# EAGLE board Proiect_TSC_Ilinca-Roxana_Tololoi (EAGLE 9.7.0), part 1 of 2
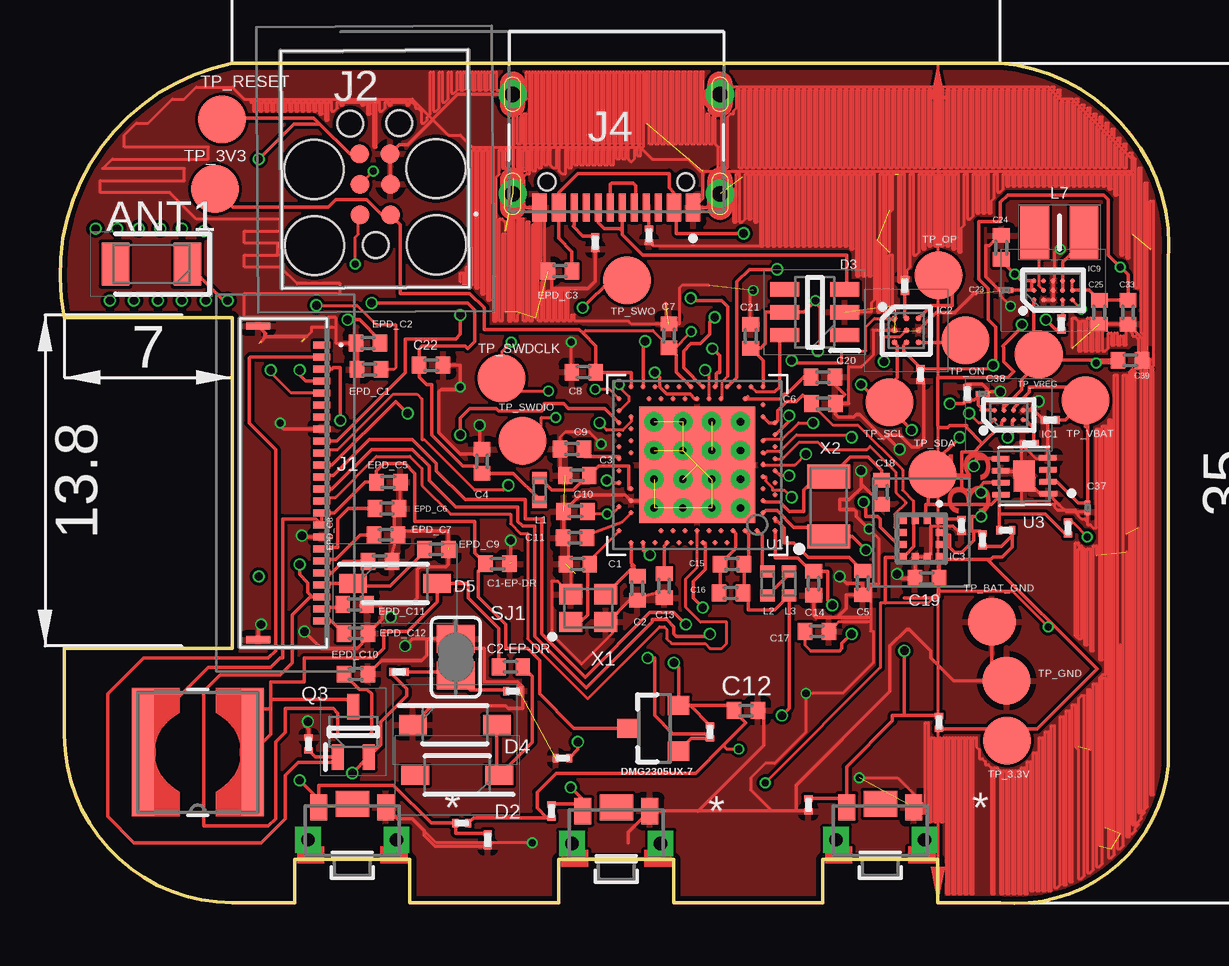
[diagram p2: board, top side]
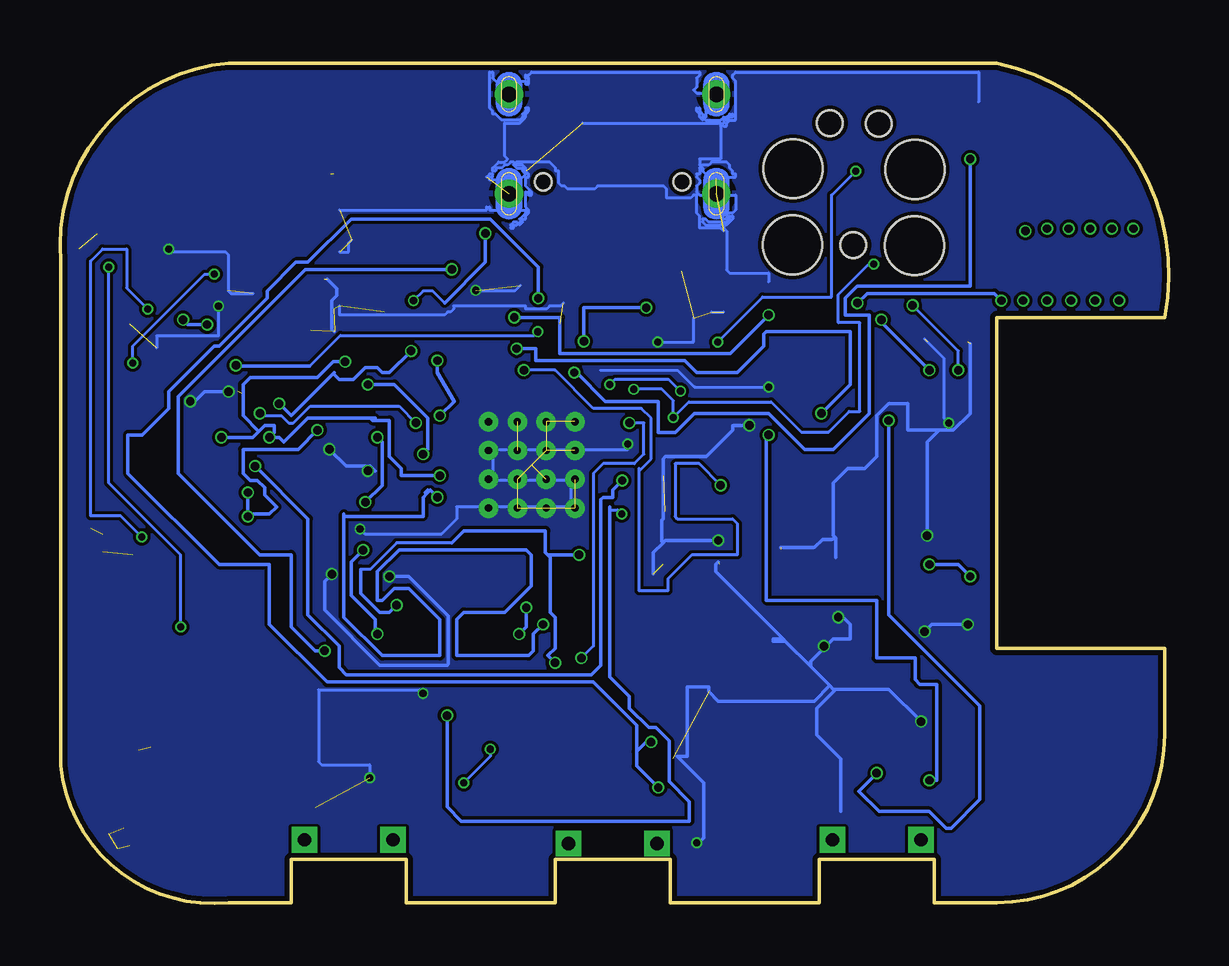
[diagram p3: board, bottom side, seen from below]

Size 46.21 x 35.03 mm. Coordinates in mm from the lower left corner, seen from the top.
Outline: 7.18,35.03 39.18,35.03 arc-90 46.18,26.73 46.18,5.73 arc-90 39.18,0.03 36.58,0.03 36.58,1.83 31.78,1.83 31.78,0.03 25.58,0.03 25.58,1.83 20.78,1.83 20.78,0.03 14.58,0.03 14.58,1.83 9.78,1.83 9.78,0.03 7.18,0.03 arc-90 0.18,7.03 0.18,10.63 7.18,10.63 7.18,24.43 0.18,24.43 arc-90 7.18,35.03
Copper layers (1+2*15+16): Top 0.035mm / dielectric 1.6mm / Route2 0.035mm / dielectric 0.15mm / Route15 0.035mm / dielectric 0.2mm / Bottom 0.035mm
Design rules "jlcpcb-2layers.dru *": minimum track width 5mil, minimum drill 0.3mm, track to track 5mil, track to pad 5mil, pad to pad 5mil, via to via 5mil, smd to smd 5mil, copper to edge 0.2mm, drill to drill 6mil, minimum pad ring 10mil, minimum via ring 3mil, stop-mask expansion 4mil, vias tented up to drill 0mil, thermal gap 10mil

## Footprints (pad centres in the part's own frame; a part is rotated, then mirrored left to right if it is on the bottom)
2450AT18B100E_ANTC3216X140N = smd 1.15 x 1.8: 1 -1.5,0; 2 1.5,0
PERFECT_0402_0402 = smd 0.6 x 0.7: 1 -0.5,0; 2 0.5,0
GRM011R60J152KE01L_2_CAPC0201X13N = smd 0.22 x 0.23: 1 -0.185,0; 2 0.185,0
GRM011R60J152KE01L_1_0201 = smd 0.35 x 0.25: 1 0,0.275; 2 0,-0.275
ESP32_C6_LIBRARY_5_SOD3716X135N = smd 1.15 x 0.8: 1 -1.75,0; 2 1.75,0
ESP32_C6_LIBRARY_3_SOT95P280X145-6N = smd 1.2 x 0.6: 1 -1.25,0.95; 2 -1.25,0; 3 -1.25,-0.95; 4 1.25,-0.95; 5 1.25,0; 6 1.25,0.95
ESP32_C6_LIBRARY_4_ESP32_C6_LIBRARY_4_ESP32_C6_LIBRARY_4_ESP32_C6_LIBRARY_4_ESP32_WROVER_SPARKFUN-DISCRETESEMI_SOT23-3 = smd 0.8 x 0.9: 1 -0.95,-1; 2 0.95,-1; 3 0,1.1
BQ25180YBGR_BGA8C40P2X4_100X155X50 = smd 0.2 x 0.2: A1 -0.2,0.6; A2 0.2,0.6; B1 -0.2,0.2; B2 0.2,0.2; C1 -0.2,-0.2; C2 0.2,-0.2; D1 -0.2,-0.6; D2 0.2,-0.6
DRV2605YZFR_BGA9C50P3X3_144X144X62 = smd 0.25 x 0.25: A1 -0.5,0.5; A2 0,0.5; A3 0.5,0.5; B1 -0.5,0; B2 0,0; B3 0.5,0; C1 -0.5,-0.5; C2 0,-0.5; C3 0.5,-0.5
BMA423_BMA423 = smd 0.3 x 0.35: 1 -0.75,-0.775; 2 -0.25,-0.775; 3 0.25,-0.775; 4 0.75,-0.775; 7 0.75,0.775; 8 0.25,0.775; 9 -0.25,0.775; 10 -0.75,0.775 | smd 0.35 x 0.3: 5 0.775,-0.25; 6 0.775,0.25; 11 -0.775,0.25; 12 -0.775,-0.25
RT6160AWSC_BGA15C40P3X5_140X230X60 = smd 0.216 x 0.216: A1 -0.4,0.8; A2 0,0.8; A3 0.4,0.8; B1 -0.4,0.4; B2 0,0.4; B3 0.4,0.4; C1 -0.4,0; C2 0,0; C3 0.4,0; D1 -0.4,-0.4; D2 0,-0.4; D3 0.4,-0.4; E1 -0.4,-0.8; E2 0,-0.8; E3 0.4,-0.8
503480-2400_5034802400 = smd 0.3 x 0.7: 1 -5.75,1.525; 2 -5.25,1.525; 3 -4.75,1.525; 4 -4.25,1.525; 5 -3.75,1.525; 6 -3.25,1.525; 7 -2.75,1.525; 8 -2.25,1.525; 9 -1.75,1.525; 10 -1.25,1.525; 11 -0.75,1.525; 12 -0.25,1.525; 13 0.25,1.525; 14 0.75,1.525; 15 1.25,1.525; 16 1.75,1.525; 17 2.25,1.525; 18 2.75,1.525; 19 3.25,1.525; 20 3.75,1.525; 21 4.25,1.525; 22 4.75,1.525; 23 5.25,1.525; 24 5.75,1.525 | smd 0.3 x 1: MP1 -6.54,-1.125; MP2 6.54,-1.125
TC2030-IDC_TC2030IDC = smd 0.783 x 0.783: 1 -0.953,-0.635; 2 -0.953,0.635; 3 0.317,-0.635; 4 0.317,0.635; 5 1.588,-0.635; 6 1.588,0.635 | hole 2.451: -2.223,-2.54; -2.223,2.54; 0.952,-2.54; 0.952,2.54 | hole 1.067: -2.223,0; 2.857,-1.016; 2.857,1.016
KH-TYPE-C-16P_KINGHELM_KH-TYPE-C-16P = smd 0.6 x 1.15: A1_B12 -3.2,4.725; A4_B9 -2.4,4.725; A9_B4 2.4,4.725; A12_B1 3.2,4.725 | smd 0.3 x 1.15: A5 -1.25,4.725; A6 -0.25,4.725; A7 0.25,4.725; A8 1.25,4.725; B5 1.75,4.725; B6 0.75,4.725; B7 -0.75,4.725; B8 -1.75,4.725 | drill 0.65 pad 1.05: SH1 -4.32,0; SH2 4.32,0; SH3 -4.32,4.15; SH4 4.32,4.15 | hole 0.7: -2.89,3.65; 2.89,3.65
NORDIC_NRF_2_RESC0402_L = smd 0.5 x 0.6: 1 -0.5,0; 2 0.5,0
ESP32_C6_LIBRARY_2_IND_4828-WE-TPC_WRE = smd 0.9 x 5.3: 1 -2.286,0; 2 2.286,0
MLP2016SR47MT0S1_INDC2016X100N = smd 1.2 x 2.2: 1 -1.028,0; 2 1.028,0
ESP32_C6_LIBRARY_6_SOT65P210X110-3N = smd 1.05 x 0.5: 1 -1.05,0.65; 2 -1.05,-0.65; 3 1.05,0
ERA-1AEB3401C_0201 = smd 0.35 x 0.25: 1 0,0.275; 2 0,-0.275
ESP32_C6_LIBRARY_7_JUMPER_SJ = smd 1.168 x 1.6: 1 -0.762,0; 2 0.762,0
2025-10-22_07-23-44_LIBRARY_SW_EVP-AKE31A_PAN = smd 0.711 x 1.092: 1 -1.4,-0.972; 2 1.4,-0.972 | drill 0.559 pad 0.914 square: 3 -1.848,0.381; 4 1.848,0.381 | smd 1.397 x 1.092: 5 0,-1.124
HECTOR_WATCH_1_TP20R = smd 2 x 2: TP 0,0
NORDIC_NRF_4_AQFN50P700X700X85_HS-74N = smd 4.85 x 4.85: P$74 0,0 | drill 0.3 pad 0.6: P$75 -1.8,1.8; P$76 -0.6,1.8; P$77 0.6,1.8; P$78 1.8,1.8; P$79 -1.8,0.6; P$80 -0.6,0.6; P$81 0.6,0.6; P$82 1.8,0.6; P$83 -1.8,-0.6; P$84 -0.6,-0.6; P$85 0.6,-0.6; P$86 1.8,-0.6; P$87 -1.8,-1.8; P$88 -0.6,-1.8; P$89 0.6,-1.8; P$90 1.8,-1.8 | smd 0.2 x 0.2: P$A8 -1.25,3.25; P$A10 -0.75,3.25; P$A12 -0.25,3.25; P$A14 0.25,3.25; P$A16 0.75,3.25; P$A18 1.25,3.25; P$A20 1.75,3.25; P$A22 2.25,3.25; P$A23 2.75,3.25; P$AA24 3.25,-2.25; P$AB2 -2.75,-2.5; P$AC5 -2,-2.75; P$AC9 -1,-2.75; P$AC11 -0.5,-2.75; P$AC13 0,-2.75; P$AC15 0.5,-2.75; P$AC17 1,-2.75; P$AC19 1.5,-2.75; P$AC21 2,-2.75; P$AC24 3.25,-2.75; P$AD2 -2.75,-3.25; P$AD4 -2.25,-3.25; P$AD6 -1.75,-3.25; P$AD8 -1.25,-3.25; P$AD10 -0.75,-3.25; P$AD12 -0.25,-3.25; P$AD14 0.25,-3.25; P$AD16 0.75,-3.25; P$AD18 1.25,-3.25; P$AD20 1.75,-3.25; P$AD22 2.25,-3.25; P$AD23 2.75,-3.25; P$B1 -3.25,2.75; P$B3 -2.5,2.75; P$B5 -2,2.75; P$B7 -1.5,2.75; P$B9 -1,2.75; P$B11 -0.5,2.75; P$B13 0,2.75; P$B15 0.5,2.75; P$B17 1,2.75; P$B19 1.5,2.75; P$B24 3.25,2.75; P$C1 -3.25,2.25; P$D2 -2.75,2; P$D23 2.75,2; P$E24 3.25,1.75; P$F2 -2.75,1.5; P$F23 2.75,1.5; P$G1 -3.25,1.25; P$H2 -2.75,1; P$H23 2.75,1; P$J1 -3.25,0.75; P$J24 3.25,0.75; P$K2 -2.75,0.5; P$L1 -3.25,0.25; P$L24 3.25,0.25; P$M2 -2.75,0; P$N1 -3.25,-0.25; P$N24 3.25,-0.25; P$P2 -2.75,-0.5; P$P23 2.75,-0.5; P$R1 -3.25,-0.75; P$R24 3.25,-0.75; P$T2 -2.75,-1; P$T23 2.75,-1; P$U1 -3.25,-1.25; P$U24 3.25,-1.25; P$V23 2.75,-1.5; P$W1 -3.25,-1.75; P$W24 3.25,-1.75; P$Y2 -2.75,-2; P$Y23 2.75,-2
ESP32_C6_LIBRARY_SON50P200X200X80-9N = smd 0.76 x 0.27: 1 -0.985,0.75; 2 -0.985,0.25; 3 -0.985,-0.25; 4 -0.985,-0.75; 5 0.985,-0.75; 6 0.985,-0.25; 7 0.985,0.25; 8 0.985,0.75 | smd 0.9 x 1.3: 9 0,0
NORDIC_NRF_BT-XTAL_2016_N = smd 0.95 x 0.85: 1 -0.725,-0.575; 2 0.725,-0.575; 3 0.725,0.575; 4 -0.725,0.575
NORDIC_NRF_1_XTAL_3215_N = smd 1 x 1.8: 1 -1.25,0; 2 1.25,0

## Placement (x,y rotation side)
ANT1  2450AT18B100E  [2450AT18B100E_ANTC3216X140N]  3.81,26.65 180 top
C1  12pF  [PERFECT_0402_0402]  21.57,14.14 180 top
C1-EP-DR  10uF  [PERFECT_0402_0402]  18.23,14.16 0 top
C2  12pF  [PERFECT_0402_0402]  24.06,13.14 270 top
C2-EP-DR  4.7uF/25V  [PERFECT_0402_0402]  18.78,9.86 180 top
C3  1pF  [PERFECT_0402_0402]  21.55,17.84 180 top
C4  1pF  [PERFECT_0402_0402]  17.58,18.43 90 top
C5  100nF  [PERFECT_0402_0402]  33.45,13.36 270 top
C6  4.7μF  [PERFECT_0402_0402]  31.81,20.84 0 top
C7  100nF  [PERFECT_0402_0402]  25.37,23.66 90 top
C8  100nF  [PERFECT_0402_0402]  21.82,22.14 180 top
C9  820pF  [PERFECT_0402_0402]  21.34,18.94 180 top
C10  N.C.  [PERFECT_0402_0402]  21.48,16.34 180 top
C11  100pF  [PERFECT_0402_0402]  21.46,15.24 180 top
C12  100nF  [PERFECT_0402_0402]  28.58,8.04 0 top
C13  N.C.  [PERFECT_0402_0402]  25.17,13.24 270 top
C14  100nF  [PERFECT_0402_0402]  31.4,13.34 270 top
C15  1.0μF  [PERFECT_0402_0402]  28,14.14 180 top
C16  47nF  [PERFECT_0402_0402]  27.95,12.94 180 top
C17  12pF  [PERFECT_0402_0402]  31.54,11.34 180 top
C18  12pF  [PERFECT_0402_0402]  34.23,17.14 90 top
C19  100uF  [PERFECT_0402_0402]  36.12,13.54 180 top
C20  4.7μF  [PERFECT_0402_0402]  31.79,21.94 0 top
C21  4.7μF  [PERFECT_0402_0402]  28.78,23.64 90 top
C22  N.C.  [PERFECT_0402_0402]  15.46,22.44 0 top
C23  0.1uF  [GRM011R60J152KE01L_2_CAPC0201X13N]  39.42,25.55 0.7 top
C24  10uF  [PERFECT_0402_0402]  39.22,27.34 270 top
C25  22uF  [PERFECT_0402_0402]  43.31,24.64 270 top
C26  1uF  [GRM011R60J152KE01L_1_0201]  37.8,21.25 0 top
C27  0.1uF  [GRM011R60J152KE01L_1_0201]  41.26,20.15 90 top
C29  1uF  [GRM011R60J152KE01L_1_0201]  17.82,2.65 180 top
C30  1uF  [GRM011R60J152KE01L_1_0201]  31.18,4.11 180 top
C31  1uF  [GRM011R60J152KE01L_1_0201]  20.94,6.05 90 top
C32  1uF  [GRM011R60J152KE01L_1_0201]  35.2,25.75 0 top
C33  22uF  [PERFECT_0402_0402]  44.5,24.64 270 top
C34  0.1uF  [GRM011R60J152KE01L_1_0201]  35.86,22.05 180 top
C37  1uF  [GRM011R60J152KE01L_2_CAPC0201X13N]  42.82,16.5 90 top
C38  1uF  [GRM011R60J152KE01L_2_CAPC0201X13N]  38.44,21.25 180 top
C39  10uF  [PERFECT_0402_0402]  44.59,22.64 0 top
D2  MBR0530  [ESP32_C6_LIBRARY_5_SOD3716X135N]  16.55,5.34 180 top
D3  USBLC6-2SC6Y  [ESP32_C6_LIBRARY_3_SOT95P280X145-6N]  31.45,24.64 180 top
D4  MBR0530  [ESP32_C6_LIBRARY_5_SOD3716X135N]  16.45,7.45 0 top
D5  MBR0530  [ESP32_C6_LIBRARY_5_SOD3716X135N]  13.96,13.34 0 top
DMG2305UX-7  20V/4.2A/52mΩ/1.4W  [ESP32_C6_LIBRARY_4_ESP32_C6_LIBRARY_4_ESP32_C6_LIBRARY_4_ESP32_C6_LIBRARY_4_ESP32_WROVER_SPARKFUN-DISCRETESEMI_SOT23-3]  24.77,7.3 90 top
EPD_C1  1uF/50V  [PERFECT_0402_0402]  12.88,22.26 0 top
EPD_C2  1uF/50V  [PERFECT_0402_0402]  12.83,23.36 0 top
EPD_C3  0.1uF/50V  [PERFECT_0402_0402]  20.83,26.36 0 top
EPD_C5  0.1uF/50V  [PERFECT_0402_0402]  13.68,17.56 180 top
EPD_C6  0.1uF/50V  [PERFECT_0402_0402]  13.63,16.46 180 top
EPD_C7  0.1uF/50V  [PERFECT_0402_0402]  13.58,15.36 180 top
EPD_C8  0.1uF/50V  [PERFECT_0402_0402]  13.33,14.26 180 top
EPD_C9  0.1uF/50V  [PERFECT_0402_0402]  15.68,14.76 180 top
EPD_C10  0.1uF/50V  [PERFECT_0402_0402]  12.33,9.56 180 top
EPD_C11  0.1uF/50V  [PERFECT_0402_0402]  12.28,12.46 180 top
EPD_C12  0.1uF/50V  [PERFECT_0402_0402]  12.33,11.26 180 top
IC1  BQ25180YBGR  [BQ25180YBGR_BGA8C40P2X4_100X155X50]  39.53,20.36 90 top
IC2  DRV2605YZFR  [DRV2605YZFR_BGA9C50P3X3_144X144X62]  35.26,23.88 0 top
IC3  BMA421  [BMA423_BMA423]  35.89,15.21 180 top
IC9  RT6160AWSC  [RT6160AWSC_BGA15C40P3X5_140X230X60]  41.38,25.56 90 top
J1  503480-2400  [503480-2400_5034802400]  9.38,17.53 270 top
J2  TC2030-IDC  [TC2030-IDC_TC2030IDC]  13.13,29.66 90.4 top
J4  KH-TYPE-C-16P  [KH-TYPE-C-16P_KINGHELM_KH-TYPE-C-16P]  23.18,33.73 180 top
L1  3.9nH  [NORDIC_NRF_2_RESC0402_L]  19.98,17.23 270 top
L2  10nH  [NORDIC_NRF_2_RESC0402_L]  29.48,13.33 270 top
L3  15nH  [NORDIC_NRF_2_RESC0402_L]  30.38,13.33 270 top
L5  68uH  [ESP32_C6_LIBRARY_2_IND_4828-WE-TPC_WRE]  5.74,6.3 180 top
L7  FTC252012SR47MBCA  [MLP2016SR47MT0S1_INDC2016X100N]  41.64,27.97 0 top
Q3  SI1308EDL-T1-GE3  [ESP32_C6_LIBRARY_6_SOT65P210X110-3N]  12.22,7.15 90 top
R1_EP_DR  10K  [ERA-1AEB3401C_0201]  14.12,9.65 270 top
R1_EP_DR1  10K  [ERA-1AEB3401C_0201]  27.08,7.15 180 top
R1_USB  5K1  [ERA-1AEB3401C_0201]  24.54,27.85 180 top
R2  0  [ERA-1AEB3401C_0201]  42,15.65 180 top
R2_EP_DR  10K  [ERA-1AEB3401C_0201]  10.36,6.65 0 top
R2_EP_DR1  10K  [ERA-1AEB3401C_0201]  36.62,7.55 0 top
R2_EP_DR2  10K  [ERA-1AEB3401C_0201]  20.48,3.85 0 top
R2_EP_DR3  10K  [ERA-1AEB3401C_0201]  16.74,3.35 90 top
R2_USB  5K1  [ERA-1AEB3401C_0201]  22.3,27.55 0 top
R3  0  [ERA-1AEB3401C_0201]  37.56,15.75 180 top
R4  0  [ERA-1AEB3401C_0201]  41.72,24.15 180 top
R9  10K  [ERA-1AEB3401C_0201]  40.38,19.15 90 top
R17  3K3  [ERA-1AEB3401C_0201]  38.44,15.15 180 top
R18  3K3  [ERA-1AEB3401C_0201]  39.4,15.55 270 top
R_TYPE_SEL  2.2  [ERA-1AEB3401C_0201]  18.86,8.85 270 top
SJ1  [ESP32_C6_LIBRARY_7_JUMPER_SJ]  16.49,10.26 270 top
SW_DN  2025-10-22_07-23-44_LIBRARY_EVP-AKE31ASW_EVP-AKE31A_PAN  [2025-10-22_07-23-44_LIBRARY_SW_EVP-AKE31A_PAN]  12.18,3.03 180 top
SW_ENT  2025-10-22_07-23-44_LIBRARY_EVP-AKE31ASW_EVP-AKE31A_PAN  [2025-10-22_07-23-44_LIBRARY_SW_EVP-AKE31A_PAN]  23.18,2.88 180 top
SW_UP  2025-10-22_07-23-44_LIBRARY_EVP-AKE31ASW_EVP-AKE31A_PAN  [2025-10-22_07-23-44_LIBRARY_SW_EVP-AKE31A_PAN]  34.18,3.03 180 top
TP_3.3V  HECTOR_WATCH_1_TPTP20R  [HECTOR_WATCH_1_TP20R]  39.45,6.78 0 top
TP_3V3  HECTOR_WATCH_1_TPTP20R  [HECTOR_WATCH_1_TP20R]  6.45,29.78 0 top
TP_BAT_GND  HECTOR_WATCH_1_TPTP20R  [HECTOR_WATCH_1_TP20R]  38.83,11.74 0 top
TP_GND  HECTOR_WATCH_1_TPTP20R  [HECTOR_WATCH_1_TP20R]  39.44,9.28 0 top
TP_ON  HECTOR_WATCH_1_TPTP20R  [HECTOR_WATCH_1_TP20R]  37.73,23.48 0 top
TP_OP  HECTOR_WATCH_1_TPTP20R  [HECTOR_WATCH_1_TP20R]  36.61,26.18 0 top
TP_RESET  HECTOR_WATCH_1_TPTP20R  [HECTOR_WATCH_1_TP20R]  6.74,32.68 0 top
TP_SCL  HECTOR_WATCH_1_TPTP20R  [HECTOR_WATCH_1_TP20R]  34.57,20.88 0 top
TP_SDA  HECTOR_WATCH_1_TPTP20R  [HECTOR_WATCH_1_TP20R]  36.36,17.88 0 top
TP_SWDCLK  HECTOR_WATCH_1_TPTP20R  [HECTOR_WATCH_1_TP20R]  18.4,21.88 0 top
TP_SWDIO  HECTOR_WATCH_1_TPTP20R  [HECTOR_WATCH_1_TP20R]  19.27,19.28 0 top
TP_SWO  HECTOR_WATCH_1_TPTP20R  [HECTOR_WATCH_1_TP20R]  23.63,25.98 0 top
TP_VBAT  HECTOR_WATCH_1_TPTP20R  [HECTOR_WATCH_1_TP20R]  42.72,20.98 0 top
TP_VREG  HECTOR_WATCH_1_TPTP20R  [HECTOR_WATCH_1_TP20R]  40.78,22.88 0 top
U1  NRF52840_QF  [NORDIC_NRF_4_AQFN50P700X700X85_HS-74N]  26.55,18.28 180 top
U3  MAX17048G+T10  [ESP32_C6_LIBRARY_SON50P200X200X80-9N]  40.18,17.81 181 top
X1  32MHz  [NORDIC_NRF_BT-XTAL_2016_N]  22.01,12.31 0 top
X2  32.768kHz  [NORDIC_NRF_1_XTAL_3215_N]  32.03,16.55 90 top